# Altium schematic sheet Block_HDMI, DP, DSI, USBSS and PCIe.SchDoc
size A3; SheetNumber: 4; SheetTotal: 16
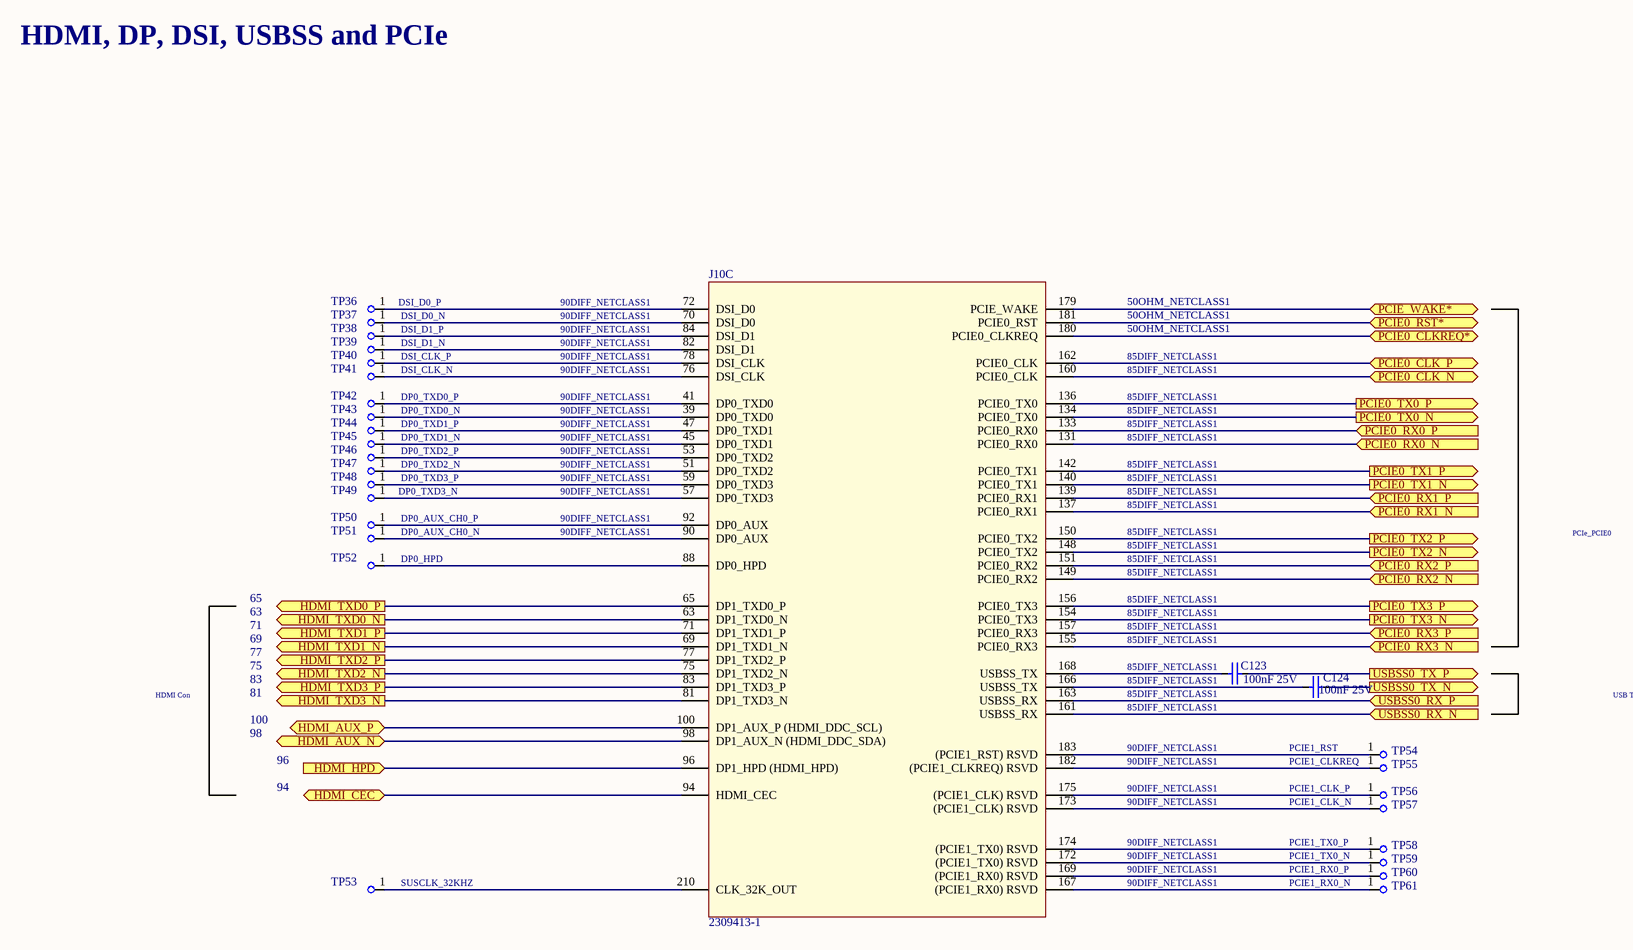
[diagram p0: Block_HDMI, DP, DSI, USBSS and PCIe.SchDoc]

## Parts
C123  100nF 25V  [C0402]
C124  100nF 25V  [C0402]
J10  2309413-1  [2309413-1]  (part C of 3)
TP36  DSI_D0_P  [TestPoint_Pad_D1.0mm]
TP37  DSI_D0_N  [TestPoint_Pad_D1.0mm]
TP38  DSI_D1_P  [TestPoint_Pad_D1.0mm]
TP39  DSI_D1_N  [TestPoint_Pad_D1.0mm]
TP40  DSI_CLK_P  [TestPoint_Pad_D1.0mm]
TP41  DSI_CLK_N  [TestPoint_Pad_D1.0mm]
TP42  DP0_TXD0_P  [TestPoint_Pad_D1.0mm]
TP43  DP0_TXD0_N  [TestPoint_Pad_D1.0mm]
TP44  DP0_TXD1_P  [TestPoint_Pad_D1.0mm]
TP45  DP0_TXD1_N  [TestPoint_Pad_D1.0mm]
TP46  DP0_TXD2_P  [TestPoint_Pad_D1.0mm]
TP47  DP0_TXD2_N  [TestPoint_Pad_D1.0mm]
TP48  DP0_TXD3_P  [TestPoint_Pad_D1.0mm]
TP49  DP0_TXD3_N  [TestPoint_Pad_D1.0mm]
TP50  DP0_AUX_CH0_P  [TestPoint_Pad_D1.0mm]
TP51  DP0_AUX_CH0_N  [TestPoint_Pad_D1.0mm]
TP52  DP0_HPD  [TestPoint_Pad_D1.0mm]
TP53  SUSCLK_32KHZ  [TestPoint_Pad_D1.0mm]
TP54  PCIE1_RST  [TestPoint_Pad_D1.0mm]
TP55  PCIE1_CLKREQ  [TestPoint_Pad_D1.0mm]
TP56  PCIE1_CLK_P  [TestPoint_Pad_D1.0mm]
TP57  PCIE1_CLK_N  [TestPoint_Pad_D1.0mm]
TP58  PCIE1_TX0_P  [TestPoint_Pad_D1.0mm]
TP59  PCIE1_TX0_N  [TestPoint_Pad_D1.0mm]
TP60  PCIE1_RX0_P  [TestPoint_Pad_D1.0mm]
TP61  PCIE1_RX0_N  [TestPoint_Pad_D1.0mm]

## Ports
HDMI_AUX_N (bidir), HDMI_AUX_P (bidir), HDMI_CEC (bidir), HDMI_HPD (in), HDMI_TXD0_N (out), HDMI_TXD0_P (out), HDMI_TXD1_N (out), HDMI_TXD1_P (out), HDMI_TXD2_N (out), HDMI_TXD2_P (out), HDMI_TXD3_N (out), HDMI_TXD3_P (out), PCIE0_CLK_N (bidir), PCIE0_CLK_P (bidir), PCIE0_CLKREQ* (bidir), PCIE0_RST* (bidir), PCIE0_RX0_N (in), PCIE0_RX0_P (in), PCIE0_RX1_N (in), PCIE0_RX1_P (in), PCIE0_RX2_N (in), PCIE0_RX2_P (in), PCIE0_RX3_N (in), PCIE0_RX3_P (in), PCIE0_TX0_N (out), PCIE0_TX0_P (out), PCIE0_TX1_N (out), PCIE0_TX1_P (out), PCIE0_TX2_N (out), PCIE0_TX2_P (out), PCIE0_TX3_N (out), PCIE0_TX3_P (out), PCIE_WAKE* (bidir), USBSS0_RX_N (in), USBSS0_RX_P (in), USBSS0_TX_N (out), USBSS0_TX_P (out)

## Nets
HDMI_AUX_N: J10.98(DP1_AUX_N_(HDMI_DDC_SDA)) ; port HDMI_AUX_N
HDMI_AUX_P: J10.100(DP1_AUX_P_(HDMI_DDC_SCL)) ; port HDMI_AUX_P
HDMI_CEC: J10.94(HDMI_CEC) ; port HDMI_CEC
HDMI_HPD: J10.96(DP1_HPD_(HDMI_HPD)) ; port HDMI_HPD
HDMI_TXD0_N: J10.63(DP1_TXD0_N) ; port HDMI_TXD0_N
HDMI_TXD0_P: J10.65(DP1_TXD0_P) ; port HDMI_TXD0_P
HDMI_TXD1_N: J10.69(DP1_TXD1_N) ; port HDMI_TXD1_N
HDMI_TXD1_P: J10.71(DP1_TXD1_P) ; port HDMI_TXD1_P
HDMI_TXD2_N: J10.75(DP1_TXD2_N) ; port HDMI_TXD2_N
HDMI_TXD2_P: J10.77(DP1_TXD2_P) ; port HDMI_TXD2_P
HDMI_TXD3_N: J10.81(DP1_TXD3_N) ; port HDMI_TXD3_N
HDMI_TXD3_P: J10.83(DP1_TXD3_P) ; port HDMI_TXD3_P
PCIE0_CLK_N: J10.160(PCIE0_CLK) ; port PCIE0_CLK_N
PCIE0_CLK_P: J10.162(PCIE0_CLK) ; port PCIE0_CLK_P
PCIE0_CLKREQ*: J10.180(PCIE0_CLKREQ) ; port PCIE0_CLKREQ*
PCIE0_RST*: J10.181(PCIE0_RST) ; port PCIE0_RST*
PCIE0_RX0_N: J10.131(PCIE0_RX0) ; port PCIE0_RX0_N
PCIE0_RX0_P: J10.133(PCIE0_RX0) ; port PCIE0_RX0_P
PCIE0_RX1_N: J10.137(PCIE0_RX1) ; port PCIE0_RX1_N
PCIE0_RX1_P: J10.139(PCIE0_RX1) ; port PCIE0_RX1_P
PCIE0_RX2_N: J10.149(PCIE0_RX2) ; port PCIE0_RX2_N
PCIE0_RX2_P: J10.151(PCIE0_RX2) ; port PCIE0_RX2_P
PCIE0_RX3_N: J10.155(PCIE0_RX3) ; port PCIE0_RX3_N
PCIE0_RX3_P: J10.157(PCIE0_RX3) ; port PCIE0_RX3_P
PCIE0_TX0_N: J10.134(PCIE0_TX0) ; port PCIE0_TX0_N
PCIE0_TX0_P: J10.136(PCIE0_TX0) ; port PCIE0_TX0_P
PCIE0_TX1_N: J10.140(PCIE0_TX1) ; port PCIE0_TX1_N
PCIE0_TX1_P: J10.142(PCIE0_TX1) ; port PCIE0_TX1_P
PCIE0_TX2_N: J10.148(PCIE0_TX2) ; port PCIE0_TX2_N
PCIE0_TX2_P: J10.150(PCIE0_TX2) ; port PCIE0_TX2_P
PCIE0_TX3_N: J10.154(PCIE0_TX3) ; port PCIE0_TX3_N
PCIE0_TX3_P: J10.156(PCIE0_TX3) ; port PCIE0_TX3_P
PCIE_WAKE*: J10.179(PCIE_WAKE) ; port PCIE_WAKE*
USBSS0_RX_N: J10.161(USBSS_RX) ; port USBSS0_RX_N
USBSS0_RX_P: J10.163(USBSS_RX) ; port USBSS0_RX_P
USBSS0_TX_N: C124.2 ; port USBSS0_TX_N
USBSS0_TX_P: C123.2 ; port USBSS0_TX_P
NetC123_1: C123.1 J10.168(USBSS_TX)
NetC124_1: C124.1 J10.166(USBSS_TX)
NetJ10_39: J10.39(DP0_TXD0) TP43.1
NetJ10_41: J10.41(DP0_TXD0) TP42.1
NetJ10_45: J10.45(DP0_TXD1) TP45.1
NetJ10_47: J10.47(DP0_TXD1) TP44.1
NetJ10_51: J10.51(DP0_TXD2) TP47.1
NetJ10_53: J10.53(DP0_TXD2) TP46.1
NetJ10_57: J10.57(DP0_TXD3) TP49.1
NetJ10_59: J10.59(DP0_TXD3) TP48.1
NetJ10_70: J10.70(DSI_D0) TP37.1
NetJ10_72: J10.72(DSI_D0) TP36.1
NetJ10_76: J10.76(DSI_CLK) TP41.1
NetJ10_78: J10.78(DSI_CLK) TP40.1
NetJ10_82: J10.82(DSI_D1) TP39.1
NetJ10_84: J10.84(DSI_D1) TP38.1
NetJ10_88: J10.88(DP0_HPD) TP52.1
NetJ10_90: J10.90(DP0_AUX) TP51.1
NetJ10_92: J10.92(DP0_AUX) TP50.1
NetJ10_167: J10.167((PCIE1_RX0)_RSVD) TP61.1
NetJ10_169: J10.169((PCIE1_RX0)_RSVD) TP60.1
NetJ10_172: J10.172((PCIE1_TX0)_RSVD) TP59.1
NetJ10_173: J10.173((PCIE1_CLK)_RSVD) TP57.1
NetJ10_174: J10.174((PCIE1_TX0)_RSVD) TP58.1
NetJ10_175: J10.175((PCIE1_CLK)_RSVD) TP56.1
NetJ10_182: J10.182((PCIE1_CLKREQ)_RSVD) TP55.1
NetJ10_183: J10.183((PCIE1_RST)_RSVD) TP54.1
NetJ10_210: J10.210(CLK_32K_OUT) TP53.1

## Notes on the sheet
- HDMI, DP, DSI, USBSS and PCIe
- 90DIFF_NETCLASS1
- 50OHM_NETCLASS1
- 85DIFF_NETCLASS1
- PCIe_PCIE0
- 63
- 65
- 83
- 75
- 77
- 69
- 71
- (near C123) 85DIFF_NETCLASS1
- HDMI Con
- 98
- 100
- 81
- USB Type-A Con (USBSS)
- 96
- 94

## Library data of the parts
C123 C124 = TMK105BJ104KV-F: CAP CER 0.1UF 25V X5R 0402 / High Value Multilayer Ceramic Capacitors (High dielectric type); Manufacturer: Taiyo Yuden; Tolerance: 10%; Supplier 1: Digi-Key; Manufacturer Part Number: TMK105BJ104KV-F; RoHS: Yes; Category: Ceramic Capacitors; Stock 1: 11997960; Pricing 1: 1=0.10000, 10=0.03700, 50=0.02000, 100=0.01630, 500=0.01166, 1000=0.00917, 2500=0.00833, 5000=0.00767 (USD); Mount: Surface Mount; Case/Package: 0402; Number of Pins: 2; Case Code (Imperial): 0402; Case Code (Metric): 1005; Weight: 2.3E-05oz; Min Operating Temperature: -55°C; Max Operating Temperature: 85°C; Capacitance: 100nF; Packaging: Tape and Reel; Dielectric: X5R; Voltage Rating (DC): 25V; Voltage Rating: 25V; Package Quantity: 1; Termination: SMD/SMT; Resistor Type: Ceramic; Voltage: 25V; Series: M; Construction: Flat; Length: 1mm; Width: 0.02inch; Height: 0.5mm; Depth: 0.5mm; Thickness: 0.022inch; Reach SVHC Compliant: Yes; Lead Free: Lead Free; Halogen Free: Halogen Free; RoHS Compliant: Yes; Supplier Part Number 1: 587-1456-1-ND
J10 = 2309413-1: Conn DDR4 DIMM Socket SKT 260 POS 0.5mm Solder RA SMD T/R; Manufacturer: TE Connectivity; Supplier 1: Mouser; Manufacturer Part Number: 2309413-1; RoHS: Yes; Category: Memory Connectors; Stock 1: 11271; Pricing 1: 1=1.81000, 10=1.54000, 50=1.54000, 100=1.47000, 1000=1.16000, 10000=1.15000 (USD); ComponentLink1URL: https://www.te.com/commerce/DocumentDelivery/DDEController?Action=srchrtrv&DocNm=2309413&DocType=Customer+Drawing&DocLang=English&src-supplier=Digi-Key; ComponentLink1Description: https://www.te.com/commerce/DocumentDelivery/DDEController?Action=srchrtrv&DocNm=2309413&DocType=Customer+Drawing&DocLang=English&src-supplier=Digi-Key; ComponentLink2URL: https://www.te.com/commerce/DocumentDelivery/DDEController?Action=srchrtrv&amp;DocNm=2309413&amp;DocType=Customer+Drawing&amp;DocLang=English&src-supplier=Digi-Key; ComponentLink2Description: https://www.te.com/commerce/DocumentDelivery/DDEController?Action=srchrtrv&amp;DocNm=2309413&amp;DocType=Customer+Drawing&amp;DocLang=English&src-supplier=Digi-Key; Supplier Part Number 1: 571-2309413-1
TP36-TP61 = TestPoint_D1mm